# Altium schematic sheet MC.1.0.0.SchDoc
size A
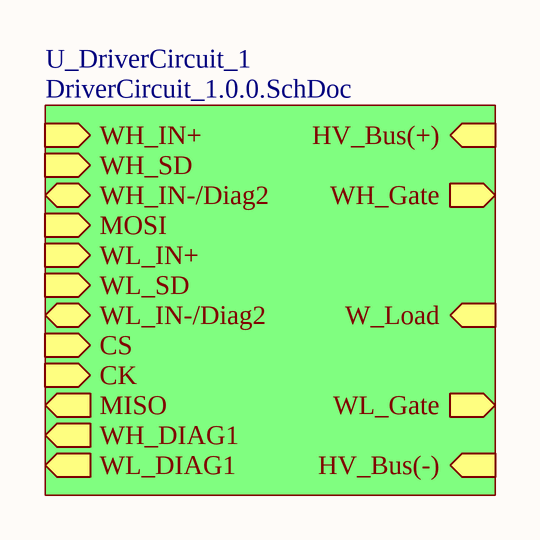
[diagram p0: MC.1.0.0.SchDoc]

## Sub-sheets
U_DriverCircuit_1 = DriverCircuit_1.0.0.SchDoc: WH_IN+ (in), WH_SD (in), WH_DIAG1 (out), WH_IN-/Diag2 (bidir), MOSI (in), WL_IN+ (in), WL_SD (in), WL_DIAG1 (out), WL_IN-/Diag2 (bidir), MISO (out), CS (in), CK (in), W_Load (in), WH_Gate (out), HV_Bus(+) (in), HV_Bus(-) (in), WL_Gate (out)